# EAGLE design keypad module (EAGLE 6.5.0)
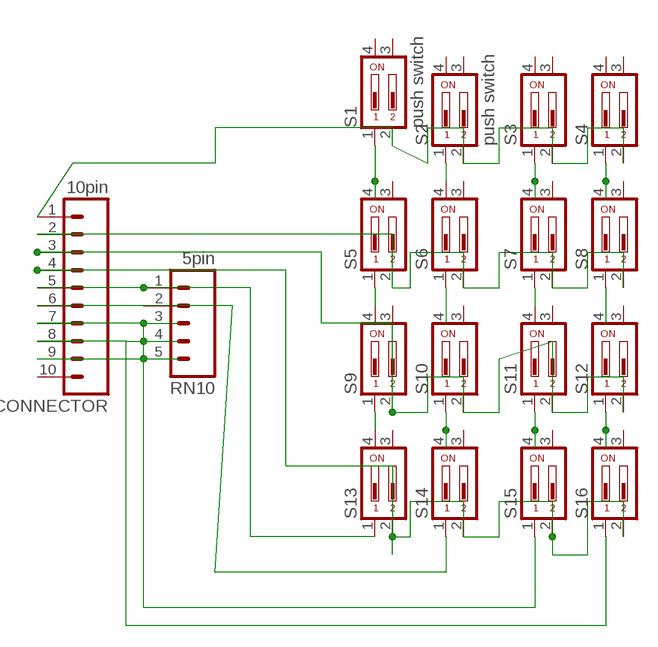
[diagram p0: schematic, sheet 1]

## Parts
CONNECTOR  10pin  M10  [10P]
RN10  5pin  M05  [05P]
S1  push switch  DP02  [DP-02]
S2  push switch  DP02  [DP-02]
S3  DP02  [DP-02]
S4  DP02  [DP-02]
S5  DP02  [DP-02]
S6  DP02  [DP-02]
S7  DP02  [DP-02]
S8  DP02  [DP-02]
S9  DP02  [DP-02]
S10  DP02  [DP-02]
S11  DP02  [DP-02]
S12  DP02  [DP-02]
S13  DP02  [DP-02]
S14  DP02  [DP-02]
S15  DP02  [DP-02]
S16  DP02  [DP-02]

## Nets
N$1: CONNECTOR.1 S1.2 S2.2 S3.2 S4.2
N$2: CONNECTOR.2 S5.2 S6.2 S7.2 S8.2
N$3: CONNECTOR.3 S9.2 S10.2 S11.2 S12.2
N$4: S7.1 S11.4
N$5: S1.1 S5.4
N$6: S5.1 S9.4
N$7: S9.1 S13.4
N$8: S2.1 S6.4
N$9: S6.1 S10.4
N$10: S10.1 S14.4
N$11: S3.1 S7.4
N$12: S4.1 S8.4
N$13: S11.1 S15.4
N$14: S12.1 S16.4
N$16: S8.1 S12.4
N$18: CONNECTOR.4 S13.2 S14.2 S15.2 S16.2
N$19: CONNECTOR.5 RN10.1 S13.1
N$20: CONNECTOR.6 RN10.2 S14.1
N$21: CONNECTOR.7 RN10.3 S15.1
N$22: CONNECTOR.8 RN10.4 S16.1
N$23: CONNECTOR.9 RN10.5
Unconnected: CONNECTOR.10 S1.3 S1.4 S2.3 S2.4 S3.3 S3.4 S4.3 S4.4 S5.3 S6.3 S7.3 S8.3 S9.3 S10.3 S11.3 S12.3 S13.3 S14.3 S15.3 S16.3

## Library data of the parts
CONNECTOR = con-amp-quick:M10: AMP QUICK CONNECTOR; OC_FARNELL: unknown; OC_NEWARK: unknown
RN10 = con-amp-quick:M05: AMP QUICK CONNECTOR; OC_FARNELL: unknown; OC_NEWARK: unknown
S1-S16 = switch-dil:DP02: DIL/CODE SWITCH; MPN: MCDP02; OC_FARNELL: 1255233; OC_NEWARK: 26M1095

## Board
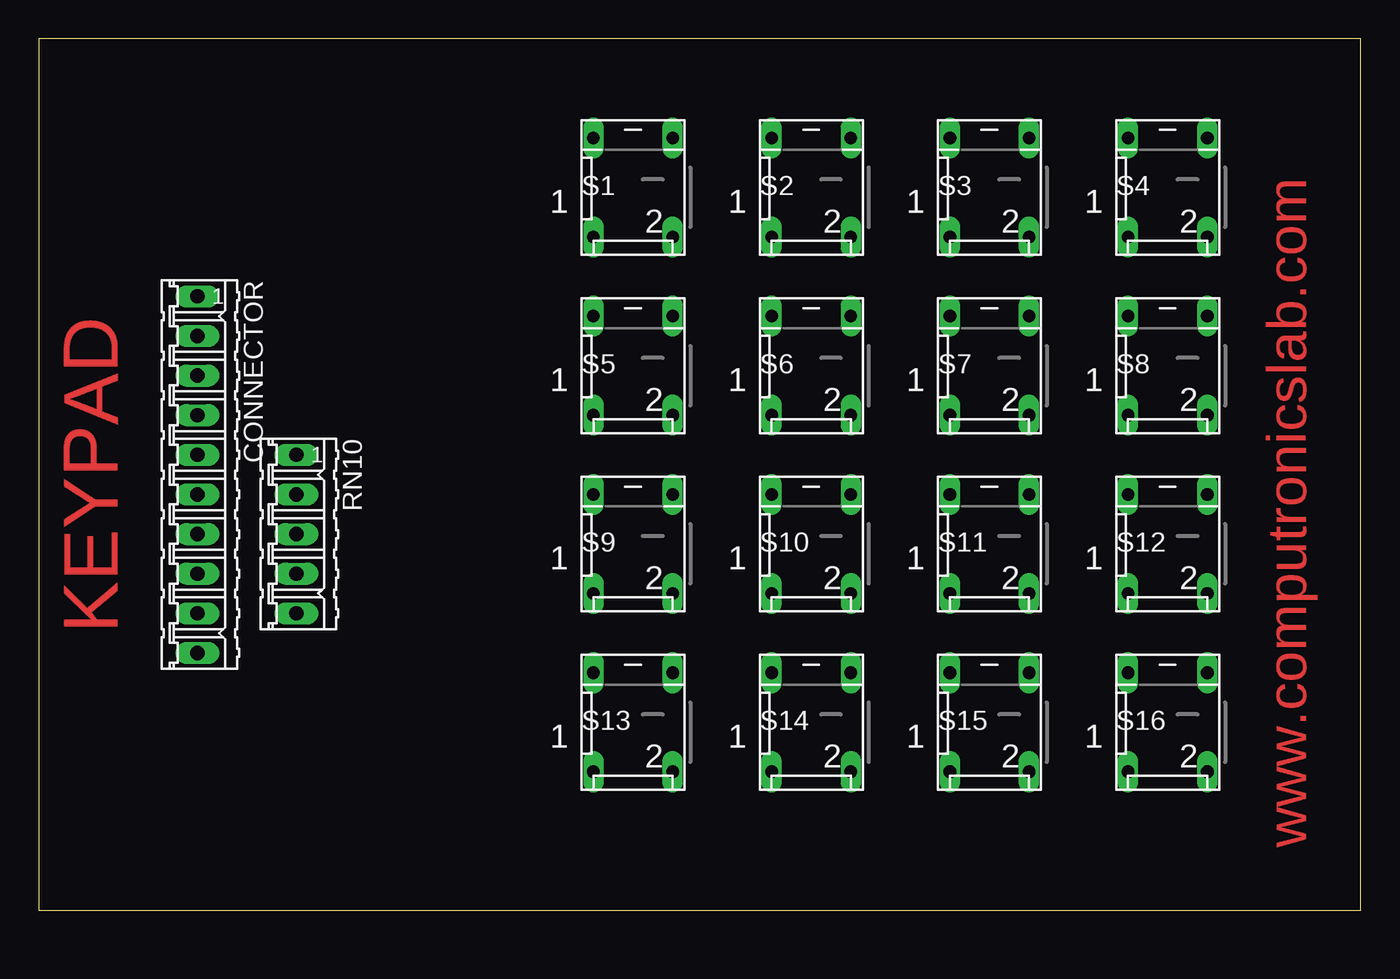
[diagram p1: board, top side]
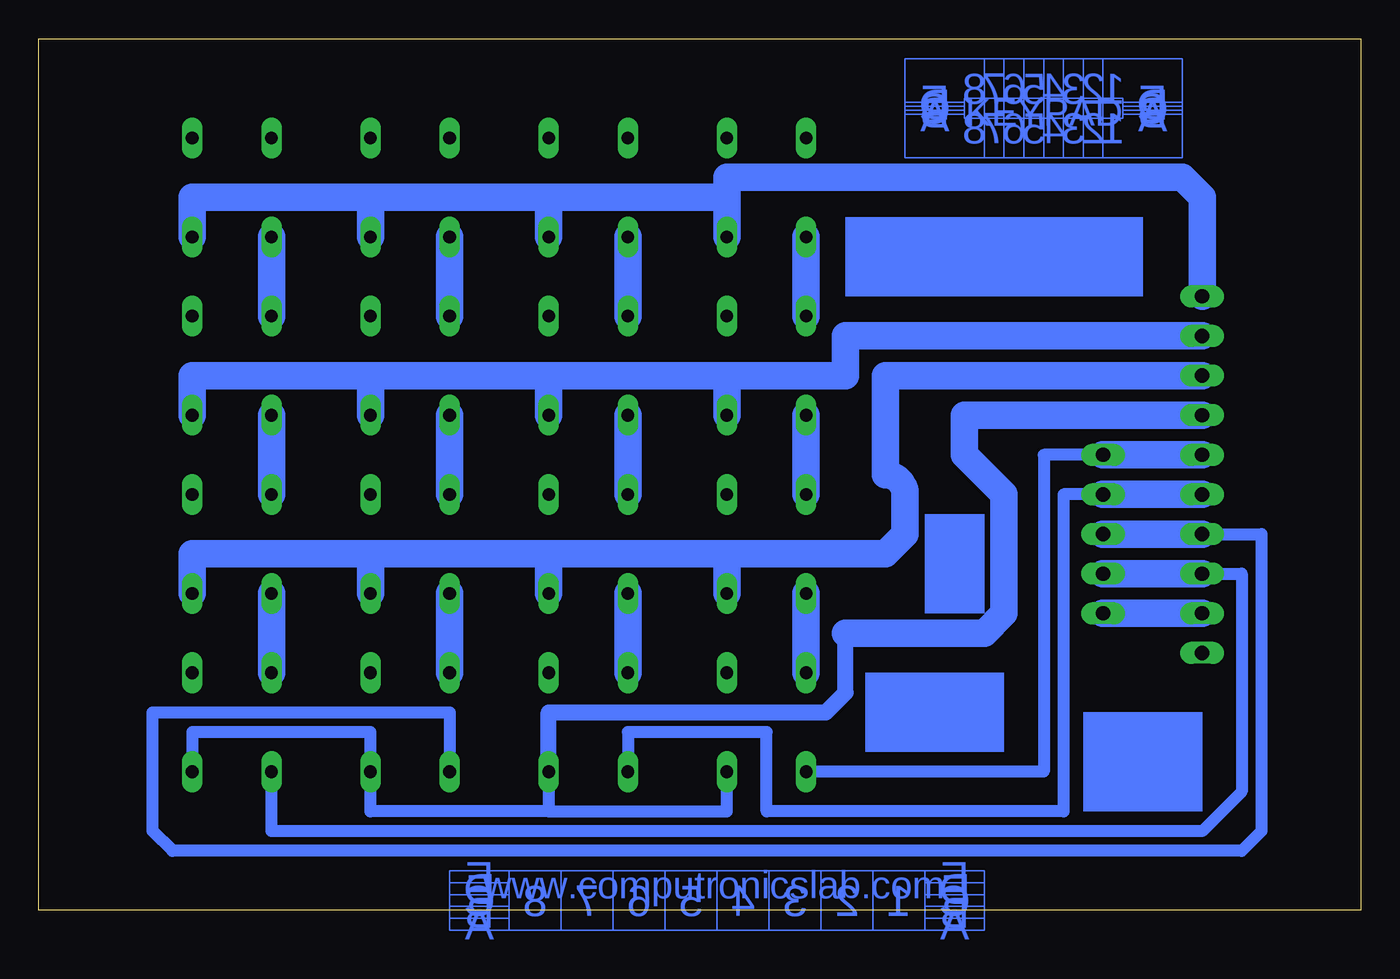
[diagram p2: board, bottom side, seen from below]

Size 84.76 x 55.87 mm. Coordinates in mm from the lower left corner, seen from the top.
Outline: 0,0 84.76,0 84.76,55.87 0,55.87 0,0
Copper layers (1*16): Top 0.035mm / dielectric 1.5mm / Bottom 0.035mm
Design rules: minimum track width 30mil, minimum drill 34mil, track to track 8mil, track to pad 8mil, pad to pad 8mil, via to via 8mil, smd to smd 8mil, copper to edge 40mil, drill to drill 8mil, minimum pad ring 10mil, minimum via ring 8mil, stop-mask expansion 4mil, vias tented up to drill 0mil, thermal gap 10mil

### Footprints (pad centres in the part's own frame; a part is rotated, then mirrored left to right if it is on the bottom)
10P = drill 0.914 long: 1 -11.43,0; 2 -8.89,0; 3 -6.35,0; 4 -3.81,0; 5 -1.27,0; 6 1.27,0; 7 3.81,0; 8 6.35,0; 9 8.89,0; 10 11.43,0
05P = drill 0.914 long: 1 -5.08,0; 2 -2.54,0; 3 0,0; 4 2.54,0; 5 5.08,0
DP-02 = drill 0.813 long: 1 -2.54,-2.54; 2 2.54,-2.54; 3 2.54,3.81; 4 -2.54,3.81

### Placement (x,y rotation side)
CONNECTOR  10.16,27.94 270 top
RN10  16.51,24.13 270 top
S1  38.1,45.72 0 top
S2  49.53,45.72 0 top
S3  60.96,45.72 0 top
S4  72.39,45.72 0 top
S5  38.1,34.29 0 top
S6  49.53,34.29 0 top
S7  60.96,34.29 0 top
S8  72.39,34.29 0 top
S9  38.1,22.86 0 top
S10  49.53,22.86 0 top
S11  60.96,22.86 0 top
S12  72.39,22.86 0 top
S13  38.1,11.43 0 top
S14  49.53,11.43 0 top
S15  60.96,11.43 0 top
S16  72.39,11.43 0 top

### Tracks (layer width: path | path; a pad name or v marks a point on that pad's centre or on a via)
N$1
  Bottom 1.778: 40.64,45.72 S1.2 | 52.07,45.72 40.64,45.72 | S2.2 52.07,45.72 | 63.5,45.72 S3.2 | 52.07,45.72 63.5,45.72 | S4.2 74.93,45.72 63.5,45.72 | CONNECTOR.1 10.16,45.72 11.43,46.99 40.64,46.99 40.64,45.72
N$2
  Bottom 1.778: 52.07,34.29 40.64,34.29 | S6.2 52.07,34.29 | 63.5,34.29 S7.2 | 52.07,34.29 63.5,34.29 | S8.2 74.93,34.29 63.5,34.29 | CONNECTOR.2 33.02,36.83 33.02,34.29 40.64,34.29 | S5.2 40.64,34.29
N$3
  Bottom 0.762: S9.2 40.64,21.59
  Bottom 1.778: 40.64,22.86 S9.2 | 52.07,22.86 40.64,22.86 | S10.2 52.07,22.86 | 63.5,22.86 S11.2 | 52.07,22.86 63.5,22.86 | S12.2 74.93,22.86 63.5,22.86 | CONNECTOR.3 30.48,34.29 30.48,27.94 arc90 29.21,26.67 29.21,24.13 30.48,22.86 40.64,22.86
N$4
  Bottom 1.778: S7.1 S11.4
N$5
  Bottom 1.778: S1.1 S5.4
N$6
  Bottom 1.778: S5.1 S9.4
N$7
  Bottom 1.778: S9.1 S13.4
N$8
  Bottom 1.778: S2.1 S6.4
N$9
  Bottom 1.778: S6.1 S10.4
N$10
  Bottom 1.778: S10.1 S14.4
N$11
  Bottom 1.778: S3.1 S7.4
N$12
  Bottom 1.778: S4.1 S8.4
N$13
  Bottom 1.778: S11.1 S15.4
N$14
  Bottom 1.778: S12.1 S16.4
N$16
  Bottom 1.778: S8.1 S12.4
N$18
  Bottom 0.762: S13.2 40.64,6.35 52.07,6.35 | S14.2 52.07,6.35 | 52.07,6.35 63.5,6.35 S15.2 63.5,11.43 74.93,11.43 S16.2
  Bottom 1.016: 33.02,17.78 33.02,13.97 34.29,12.7 52.07,12.7 S14.2
  Bottom 1.778: CONNECTOR.4 25.4,31.75 25.4,29.21 22.86,26.67 22.86,19.05 24.13,17.78 33.02,17.78
N$19
  Bottom 0.762: S13.1 20.32,8.89 20.32,29.21 RN10.1
  Bottom 1.778: RN10.1 CONNECTOR.5
N$20
  Bottom 0.762: S14.1 46.99,11.43 38.1,11.43 38.1,6.35 19.05,6.35 19.05,26.67 RN10.2
  Bottom 1.778: RN10.2 CONNECTOR.6
N$21
  Bottom 0.762: S15.1 58.42,12.7 77.47,12.7 77.47,5.08 76.2,3.81 7.62,3.81 6.35,5.08 6.35,24.13 CONNECTOR.7
  Bottom 1.778: CONNECTOR.7 RN10.3
N$22
  Bottom 0.762: S16.1 69.85,5.08 10.16,5.08 7.62,7.62 7.62,21.59 CONNECTOR.8
  Bottom 1.778: CONNECTOR.8 RN10.4
N$23
  Bottom 1.778: RN10.5 CONNECTOR.9
(copper drawn outside any net)
  shapes: Bottom area x6

### Text on the board
Top: www.computronicslab.com | KEYPAD
Bottom: KEYPAD | www.computronicslab.com